# Altium schematic sheet SCH-Orange_PI_Power_Hat_Sheet_1_Altium.schdoc
size 166 x 124 mm
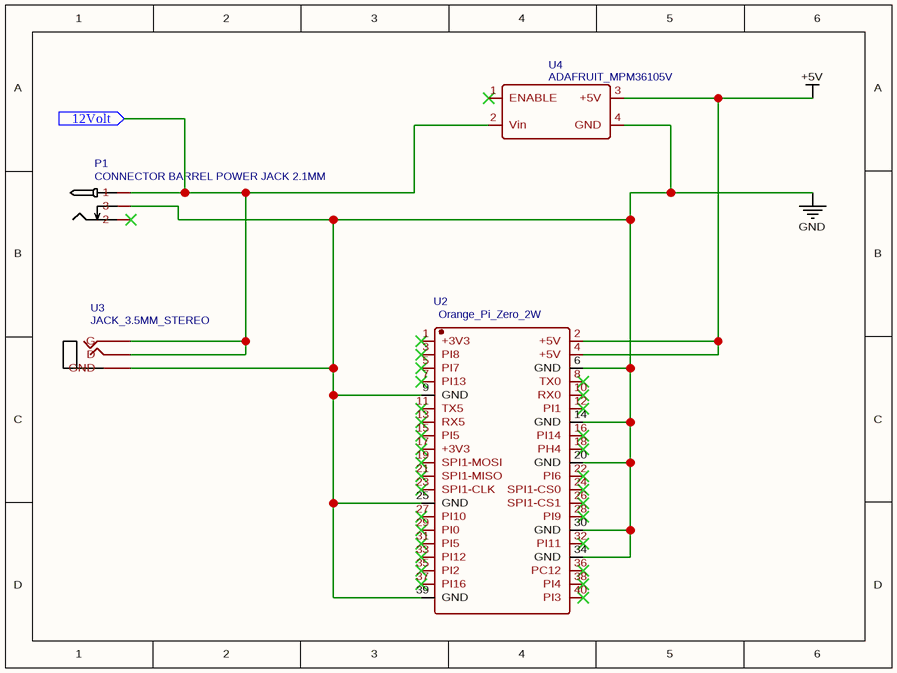
[diagram p0: SCH-Orange_PI_Power_Hat_Sheet_1_Altium.schdoc]

## Parts
P1  CONNECTOR BARREL POWER JACK 2.1MM  [BARREL POWER JACK 2.1MM]
U2  Orange_Pi_Zero_2W  [PI ZERO WITH HOLES]
U3  JACK_3.5MM_STEREO  [AUDIO_JACK_3.5MM_STEREO]
U4  ADAFRUIT_MPM36105V  [ADAFRUIT_MPM3610_MODULE5]

## Ports
12Volt (in)

## Nets
+5V: U2.2(+5V) U2.4(+5V) U4.3(+5V)
GND: P1.3 U2.6(GND) U2.9(GND) U2.14(GND) U2.20(GND) U2.25(GND) U2.30(GND) U2.34(GND) U2.39(GND) U3.3(GND) U4.4(GND)
12Volt: P1.1 U3.1(G) U3.2(D) U4.2(Vin) ; port 12Volt

Not connected (* = marked no-connect by the designer): P1 2*; U2 1(+3V3)* 3(PI8)* 5(PI7)* 7(PI13)* 8(TX0)* 10(RX0)* 11(TX5)* 12(PI1)* 13(RX5)* 15(PI5)* 16(PI14)* 17(+3V3)* 18(PH4)* 19(SPI1-MOSI)* 21(SPI1-MISO)* 22(PI6)* 23(SPI1-CLK)* 24(SPI1-CS0)* 26(SPI1-CS1)* 27(PI10)* 28(PI9)* 29(PI0)* 31(PI5)* 32(PI11)* 33(PI12)* 35(PI2)* 36(PC12)* 37(PI16)* 38(PI4)* 40(PI3)*; U4 1(ENABLE)*

## Library data of the parts
P1 = CONNECTOR BARREL POWER JACK 2.1MM: Contributor: Jan-Haase18; Supplier: Reichelt; spicePre: P; spiceSymbolName: CONNECTOR BARREL POWER JACK 2.1MM
U2 = Orange_Pi_Zero_2W: Manufacturer Part: Raspberry Pi Zero W V1.3; Contributor: gillfish101; link: https://thepihut.com/products/raspberry-pi-zero-w; spicePre: U; spiceSymbolName: Raspberry_Pi_Zero_W
U3 = JACK_3.5MM_STEREO: Manufacturer Part: ST-029 AUDIO JACK 3.5mm; Contributor: jaouad; link: https://lib.chipdip.ru/251/DOC000251805.pdf; e: e; spicePre: U; spiceSymbolName: JACK_3.5MM_STEREO
U4 = ADAFRUIT_MPM36105V: Contributor: Aidan Farley; Supplier: Digi-Key; JLCPCB Part Class: Extended Part; spicePre: U; spiceSymbolName: ADAFRUIT_MPM36105V